# EAGLE design rtk-000-001-v3-rev1 (EAGLE 7.3.0)
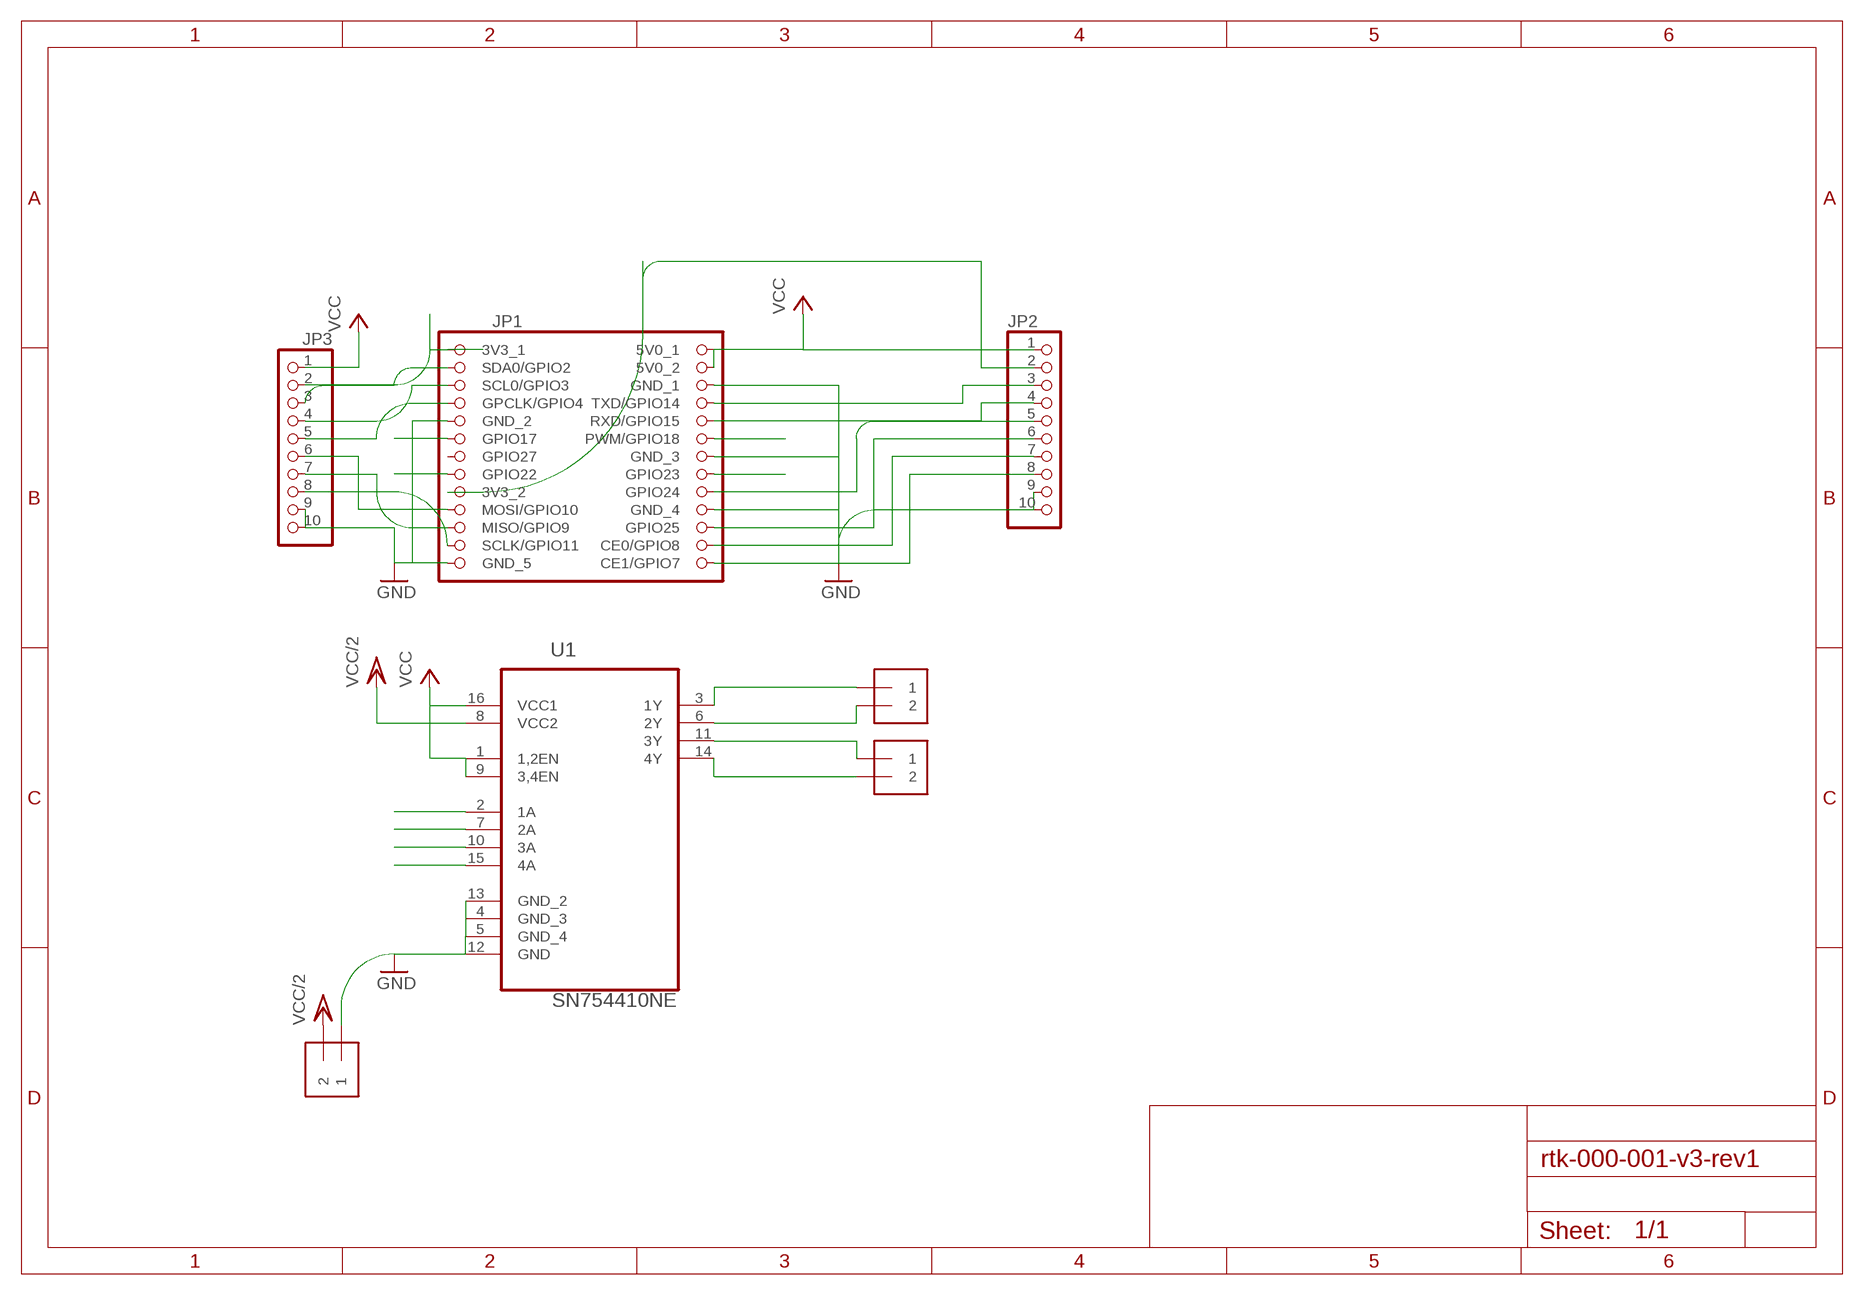
[diagram p0: schematic, sheet 1]

## Parts
JP1  RPIGPIOPINHD-2X13  [2X13]
JP2  PINHD-1X10  [1X10]
JP3  PINHD-1X10  [1X10]
MOTOR-1  1X2-3.5MM  [3.5MMTERM]
MOTOR-2  1X2-3.5MM  [3.5MMTERM]
U1  SN754410NE  [DIP254P762X508-16]
VCC2  1X2-3.5MM  [3.5MMTERM]

## Nets
17: JP1.11(GPIO17) U1.2(1A)
18: JP1.12(PWM/GPIO18) U1.7(2A)
22: JP1.15(GPIO22) U1.10(3A)
23: JP1.16(GPIO23) U1.15(4A)
GND: JP1.6(GND_1) JP1.9(GND_2) JP1.14(GND_3) JP1.20(GND_4) JP1.25(GND_5) JP2.9 JP2.10 JP3.9 JP3.10 U1.4(GND_3) U1.5(GND_4) U1.12(GND) U1.13(GND_2) VCC2.1
GPIO24: JP1.18(GPIO24) JP2.5
GPIO25: JP1.22(GPIO25) JP2.6
N$1: MOTOR-2.1 U1.11(3Y)
N$2: JP1.7(GPCLK/GPIO4) JP3.5
N$3: JP1.23(SCLK/GPIO11) JP3.8
N$4: MOTOR-2.2 U1.14(4Y)
N$5: MOTOR-1.2 U1.6(2Y)
N$6: MOTOR-1.1 U1.3(1Y)
N$7: JP1.19(MOSI/GPIO10) JP3.6
N$8: JP1.3(SDA0/GPIO2) JP3.3
N$9: JP1.5(SCL0/GPIO3) JP3.4
N$10: JP1.21(MISO/GPIO9) JP3.7
N$11: JP1.8(TXD/GPIO14) JP2.3
N$12: JP1.10(RXD/GPIO15) JP2.4
N$14: JP1.17(3V3_2) JP2.2
N$15: JP1.1(3V3_1) JP3.2
N$16: JP1.24(CE0/GPIO8) JP2.7
N$17: JP1.26(CE1/GPIO7) JP2.8
VCC: JP1.2(5V0_1) JP1.4(5V0_2) JP2.1 JP3.1 U1.1(1,2EN) U1.9(3,4EN) U1.16(VCC1)
VCC/2: U1.8(VCC2) VCC2.2
Unconnected: JP1.13(GPIO27)

## Library data of the parts
JP1 = pimoroni2:RPIGPIOPINHD-2X13: RASPBERRY PI GPIO PIN HEADER
JP2 JP3 = pinhead:PINHD-1X10: PIN HEADER
MOTOR-1 MOTOR-2 VCC2 = adafruit:1X2: 3.5mm Terminal block http://www.ladyada.net/library/pcb/eaglelibrary.html
U1 = Texas Instruments_By_element14_Batch_1:SN754410NE: QUADRUPLE HALF-H DRIVERS; MPN: SN754410NE; OC_FARNELL: 1470411; OC_NEWARK: 08F8145; PACKAGE: PDIP-16; SUPPLIER: Texas Instruments

## Board
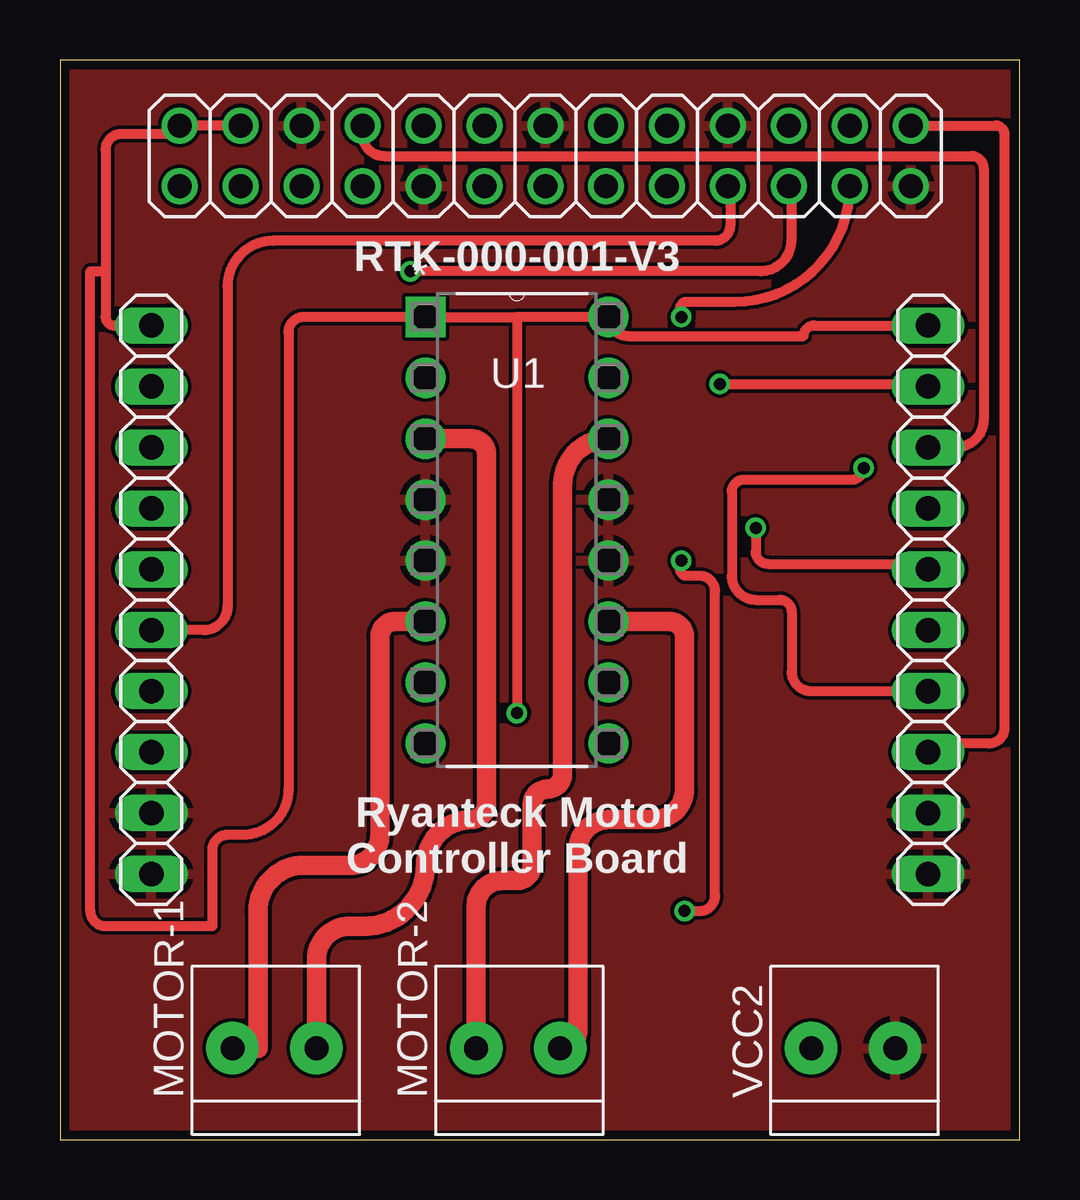
[diagram p1: board, top side]
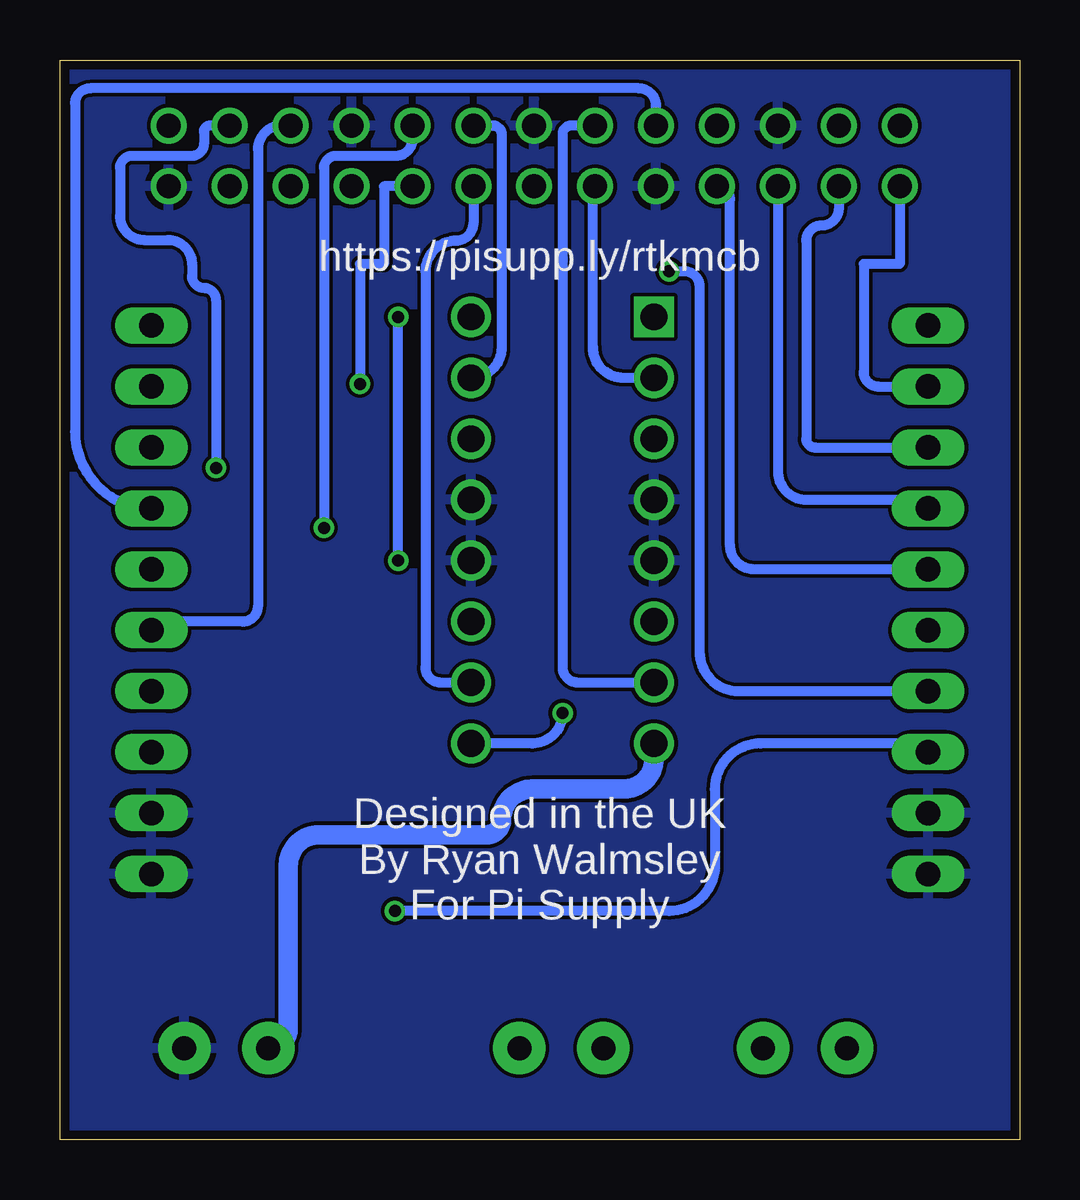
[diagram p2: board, bottom side, seen from below]

Size 40 x 45 mm. Coordinates in mm from the lower left corner, seen from the top.
Outline: 0,0 40,0 40,45 0,45 0,0
Copper layers (1*16): Top 0.0356mm / dielectric 1.5011mm / Bottom 0.0356mm
Design rules "LaenPCBOrder": minimum track width 6mil, minimum drill 13mil, track to track 6mil, track to pad 6mil, pad to pad 6mil, via to via 6mil, smd to smd 6mil, copper to edge 15mil, drill to drill 6mil, minimum pad ring 7mil, minimum via ring 7mil, stop-mask expansion 3mil, vias tented up to drill 0mil, thermal gap 10mil

### Footprints (pad centres in the part's own frame; a part is rotated, then mirrored left to right if it is on the bottom)
2X13 = drill 1: 1 -16.51,-1.27; 2 -16.51,1.27; 3 -13.97,-1.27; 4 -13.97,1.27; 5 -11.43,-1.27; 6 -11.43,1.27; 7 -8.89,-1.27; 8 -8.89,1.27; 9 -6.35,-1.27; 10 -6.35,1.27; 11 -3.81,-1.27; 12 -3.81,1.27; 13 -1.27,-1.27; 14 -1.27,1.27; 15 1.27,-1.27; 16 1.27,1.27; 17 3.81,-1.27; 18 3.81,1.27; 19 6.35,-1.27; 20 6.35,1.27; 21 8.89,-1.27; 22 8.89,1.27; 23 11.43,-1.27; 24 11.43,1.27; 25 13.97,-1.27; 26 13.97,1.27
1X10 = drill 1.016 long: 1 -11.43,0; 2 -8.89,0; 3 -6.35,0; 4 -3.81,0; 5 -1.27,0; 6 1.27,0; 7 3.81,0; 8 6.35,0; 9 8.89,0; 10 11.43,0
3.5MMTERM = drill 1 pad 2.184: 1 1.8,0; 2 -1.7,0
DIP254P762X508-16 = drill 1.118 square: 1 -7.62,17.78 | drill 1.118: 2 -7.62,15.24; 3 -7.62,12.7; 4 -7.62,10.16; 5 -7.62,7.62; 6 -7.62,5.08; 7 -7.62,2.54; 8 -7.62,0; 9 0,0; 10 0,2.54; 11 0,5.08; 12 0,7.62; 13 0,10.16; 14 0,12.7; 15 0,15.24; 16 0,17.78

### Placement (x,y rotation side)
JP1  21.5,41 0 top
JP2  36.19,22.5 270 top
JP3  3.81,22.5 270 top
MOTOR-1  8.89,3.81 0 top
MOTOR-2  19.05,3.81 0 top
U1  22.86,16.51 0 top
VCC2  33.02,3.81 0 top

### Tracks (layer width: path | path; a pad name or v marks a point on that pad's centre or on a via)
17
  Bottom 0.406: U1.2 16.51,31.75 arc90 17.78,33.02 17.78,39.64 arc90 JP1.11
18
  Bottom 0.406: JP1.12 18.69,42.27 arc-90 19.05,41.91 19.05,19.68 arc-90 18.41,19.05 U1.7
22
  Bottom 0.406: JP1.15 22.77,38.19 arc90 23.5,37.47 arc-90 24.77,36.2 24.77,19.68 arc-90 24.13,19.05 U1.10
23
  Bottom 0.406: JP1.16 21.95,42.27 arc90 21.59,41.91 21.59,33.02 arc90 U1.15
GND
  pour Bottom: -2.54,-1.27 -2.54,49.53 45.72,50.8 41.91,-1.27
  pour Top: -1.27,-1.27 0,48.26 43.18,48.26 43.18,-1.27
GPIO24  (via drill 0.5)
  Top 0.406: v29,25.5 29,24.5 arc90 29.5,24 35.96,24 arc-90 JP2.5
  Bottom 0.406: JP1.18 25.31,41.69 arc90 26,41 28.5,41 arc-90 29,40.5 v29,25.5
GPIO25
  Bottom 0.406: JP1.22 30.75,42.27 arc-90 31.75,41.27 31.75,22.23 arc90 32.38,21.59 35.83,21.59 arc-90 JP2.6
N$1
  Top 0.813: MOTOR-2.1 arc90 21.59,4.55 21.59,12.06 arc-90 22.86,13.34 24.77,13.34 arc90 26.04,14.61 26.04,20.95 arc90 25.4,21.59 U1.11
N$2
  Bottom 0.406: JP3.5 11.07,23.77 arc90 12.06,24.77 12.06,39.19 arc-90 JP1.7
N$3  (via drill 0.5)
  Top 0.406: v26.04,9.53 26.67,9.53 arc90 27.3,10.16 27.3,22.86 arc90 26.67,23.5 26.04,23.5 arc-90 v25.9,24.13 | v25.9,34.29 arc-90 26.04,34.92 28.12,34.92 arc90 JP1.23
  Bottom 0.406: JP3.8 arc-90 4.17,16.51 10.79,16.51 arc-90 12.7,14.61 12.7,11.43 arc90 14.61,9.53 v26.04,9.53 | v25.9,24.13 v25.9,34.29
N$4
  Top 0.813: MOTOR-2.2 17.35,9.73 arc-90 18.41,10.79 19.05,10.79 arc90 19.68,11.43 19.68,13.97 arc-90 20.32,14.61 arc90 20.95,15.24 20.95,27.3 arc-90 U1.14
N$5
  Top 0.813: MOTOR-1.2 8.26,3.81 8.26,9.53 arc-90 10.16,11.43 12.06,11.43 arc90 13.34,12.7 13.34,20.95 arc-90 13.97,21.59 U1.6
N$6
  Top 0.813: MOTOR-1.1 10.69,7.51 arc-90 12.06,8.89 12.7,8.89 arc90 15.24,11.43 arc-90 17.14,13.34 arc90 17.78,13.97 17.78,28.57 arc90 17.14,29.21 U1.3
N$7
  Top 0.406: JP1.19 arc-90 27.94,39.64 27.94,38.1 arc-90 27.3,37.47 8.89,37.47 arc90 6.99,35.56 6.99,22.23 arc-90 5.99,21.23 JP3.6
N$8
  Bottom 0.406: JP1.3 7.53,38.83 arc90 8.26,38.1 arc-90 8.89,37.47 8.89,29.21 arc-90 8.53,28.85 JP3.3
N$9
  Bottom 0.406: JP1.5 10.07,27.85 arc-90 8.89,26.67 2.9,26.67 arc90 JP3.4
N$10  (via drill 0.5)
  Top 0.406: JP1.21 arc-90 30.48,39.64 30.48,37.47 arc-90 29.21,36.2 v14.61,36.2
  Bottom 0.406: v14.61,36.2 13.97,36.2 arc90 13.34,35.56 13.34,20.32 arc-90 11.71,18.69 JP3.7
N$11
  Top 0.406: JP1.8 12.61,41.89 arc90 13.5,41 38,41 arc-90 38.5,40.5 38.5,30 arc-90 37.35,28.85 JP2.3
N$12
  Bottom 0.406: JP1.10 15.15,43.09 arc-90 15.88,43.81 38.73,43.81 arc-90 39.37,43.18 39.37,29.49 arc-90 JP2.4
N$14  (via drill 0.5)
  Top 0.406: v27.5,31.5 36.19,31.5 JP2.2
  Bottom 0.406: JP1.17 26.5,39.73 26.5,36.5 27.5,36.5 v27.5,31.5
N$15
  Bottom 0.406: JP1.1 5,36.5 6.5,36.5 6.5,32 arc-90 5.89,31.39 JP3.2
N$16  (via drill 0.5)
  Top 0.406: v33.5,28 arc-90 33,27.5 28.5,27.5 arc90 28,27 28,23.5 arc90 29,22.5 30,22.5 arc-90 30.5,22 30.5,19.5 arc90 31.31,18.69 JP2.7
  Bottom 0.406: JP1.24 33.73,42.27 arc-90 34,42 34,41.5 arc90 34.5,41 37,41 arc-90 37.5,40.5 37.5,38.5 arc-90 36.5,37.5 35.5,37.5 arc90 34.5,36.5 34.5,36 arc-90 34,35.5 arc90 33.5,35 v33.5,28
N$17
  Top 0.406: JP1.26 39.01,42.27 arc-90 39.37,41.91 39.37,17.14 arc-90 38.73,16.51 36.55,16.51 arc90 JP2.8
VCC  (via drill 0.5)
  Top 0.406: 3.81,34.29 JP3.1 2.27,33.93 arc-90 1.91,34.29 1.91,36.2 | 19.05,34.29 U1.16 arc90 23.65,33.5 31,33.5 arc-90 31.43,33.93 JP2.1 | JP1.4 JP1.2 arc-90 4.63,41.91 2.54,41.91 arc90 1.91,41.27 1.91,36.2 | 19.05,34.29 U1.1 10.16,34.29 arc90 9.53,33.66 9.53,14.61 arc-90 7.62,12.7 6.99,12.7 arc90 6.35,12.06 6.35,8.89 1.91,8.89 arc-90 1.27,9.53 1.27,36.2 1.91,36.2 | 19.05,34.29 v19.05,17.78
  Bottom 0.406: v19.05,17.78 arc90 20.32,16.51 U1.9
VCC/2
  Bottom 0.813: U1.8 15.24,15.88 arc90 16.51,14.61 20.32,14.61 arc-90 21.59,13.34 arc90 22.23,12.7 29.21,12.7 arc-90 30.48,11.43 30.48,4.65 arc90 VCC2.2

### Text on the board
tNames: RTK-000-001-V3 | Ryanteck Motor / Controller Board
bNames: https://pisupp.ly/rtkmcb | Designed in the UK / By Ryan Walmsley / For Pi Supply
tValues: 5V | 5V | 3V3 | 3V3 | SDA | SERIAL | TXD | I2C | SCL | RXD | GPIO4 | GPIO24 | MOSI | GPIO25 | MISO | SPI | CE0 | SPI | SCLK | CE1 | GND | GND | GND | GND | 17-18 | 22-23 | + -